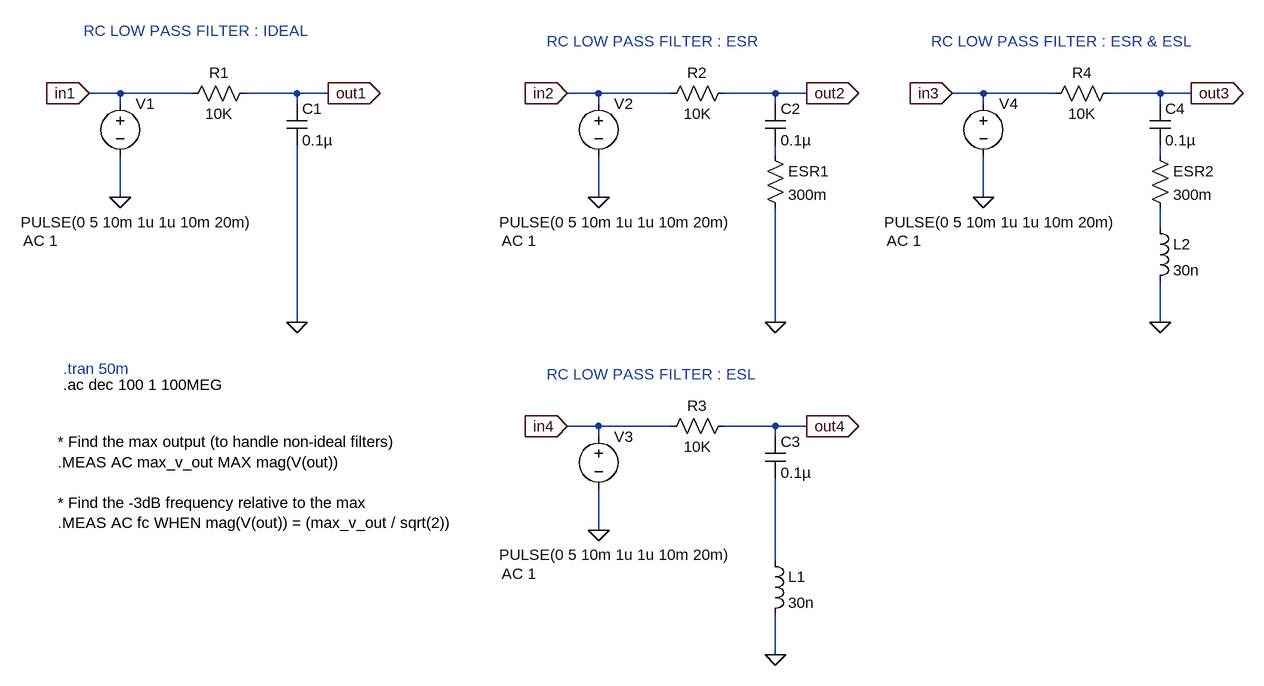
[diagram p0: schematic low_pass_filter_rc_ESR_ESL.asc]
low_pass_filter_rc_ESR_ESL.asc, the LTspice schematic file:
Version 4.1
SHEET 1 1392 980
WIRE -384 96 -432 96
WIRE -272 96 -384 96
WIRE -112 96 -192 96
WIRE -64 96 -112 96
WIRE 352 96 304 96
WIRE 464 96 352 96
WIRE 624 96 544 96
WIRE 672 96 624 96
WIRE 944 96 896 96
WIRE 1056 96 944 96
WIRE 1216 96 1136 96
WIRE 1264 96 1216 96
WIRE -384 112 -384 96
WIRE -112 112 -112 96
WIRE 352 112 352 96
WIRE 624 112 624 96
WIRE 944 112 944 96
WIRE 1216 112 1216 96
WIRE 624 192 624 176
WIRE 1216 192 1216 176
WIRE -384 256 -384 192
WIRE 352 256 352 192
WIRE 944 256 944 192
WIRE 1216 304 1216 272
WIRE -112 448 -112 176
WIRE 624 448 624 272
WIRE 1216 448 1216 384
WIRE 352 608 304 608
WIRE 464 608 352 608
WIRE 624 608 544 608
WIRE 672 608 624 608
WIRE 352 624 352 608
WIRE 624 624 624 608
WIRE 352 768 352 704
WIRE 624 816 624 688
WIRE 624 960 624 896
FLAG -384 256 0
FLAG -112 448 0
FLAG -432 96 in1
IOPIN -432 96 In
FLAG -64 96 out1
IOPIN -64 96 Out
FLAG 352 256 0
FLAG 624 448 0
FLAG 304 96 in2
IOPIN 304 96 In
FLAG 672 96 out2
IOPIN 672 96 Out
FLAG 352 768 0
FLAG 624 960 0
FLAG 304 608 in4
IOPIN 304 608 In
FLAG 672 608 out4
IOPIN 672 608 Out
FLAG 944 256 0
FLAG 1216 448 0
FLAG 896 96 in3
IOPIN 896 96 In
FLAG 1264 96 out3
IOPIN 1264 96 Out
SYMBOL res -176 80 R90
WINDOW 0 0 56 VBottom 2
WINDOW 3 32 56 VTop 2
SYMATTR InstName R1
SYMATTR Value 10K
SYMATTR SpiceLine tol=1 pwr=0.1
SYMBOL cap -128 112 R0
SYMATTR InstName C1
SYMATTR Value 0.1µ
SYMATTR SpiceLine V=4 Irms=0 Rser=0 Lser=0 mfg="Murata" pn="GRM022R60G153KE15" type="X5R"
SYMBOL voltage -384 96 R0
WINDOW 3 -153 198 Left 2
WINDOW 123 -149 227 Left 2
WINDOW 39 0 0 Left 0
SYMATTR Value PULSE(0 5 10m 1u 1u 10m 20m)
SYMATTR Value2 AC 1
SYMATTR InstName V1
SYMBOL res 560 80 R90
WINDOW 0 0 56 VBottom 2
WINDOW 3 32 56 VTop 2
SYMATTR InstName R2
SYMATTR Value 10K
SYMATTR SpiceLine tol=1 pwr=0.1
SYMBOL cap 608 112 R0
SYMATTR InstName C2
SYMATTR Value 0.1µ
SYMATTR SpiceLine V=4 Irms=0 Rser=0 Lser=0 mfg="Murata" pn="GRM022R60G153KE15" type="X5R"
SYMBOL voltage 352 96 R0
WINDOW 3 -153 198 Left 2
WINDOW 123 -149 227 Left 2
WINDOW 39 0 0 Left 0
SYMATTR Value PULSE(0 5 10m 1u 1u 10m 20m)
SYMATTR Value2 AC 1
SYMATTR InstName V2
SYMBOL res 608 176 R0
SYMATTR InstName ESR1
SYMATTR Value 300m
SYMBOL res 560 592 R90
WINDOW 0 0 56 VBottom 2
WINDOW 3 32 56 VTop 2
SYMATTR InstName R3
SYMATTR Value 10K
SYMATTR SpiceLine tol=1 pwr=0.1
SYMBOL cap 608 624 R0
SYMATTR InstName C3
SYMATTR Value 0.1µ
SYMATTR SpiceLine V=4 Irms=0 Rser=0 Lser=0 mfg="Murata" pn="GRM022R60G153KE15" type="X5R"
SYMBOL voltage 352 608 R0
WINDOW 3 -153 198 Left 2
WINDOW 123 -149 227 Left 2
WINDOW 39 0 0 Left 0
SYMATTR Value PULSE(0 5 10m 1u 1u 10m 20m)
SYMATTR Value2 AC 1
SYMATTR InstName V3
SYMBOL ind 608 800 R0
SYMATTR InstName L1
SYMATTR Value 30n
SYMATTR SpiceLine Rser=0
SYMBOL res 1152 80 R90
WINDOW 0 0 56 VBottom 2
WINDOW 3 32 56 VTop 2
SYMATTR InstName R4
SYMATTR Value 10K
SYMATTR SpiceLine tol=1 pwr=0.1
SYMBOL cap 1200 112 R0
SYMATTR InstName C4
SYMATTR Value 0.1µ
SYMATTR SpiceLine V=4 Irms=0 Rser=0 Lser=0 mfg="Murata" pn="GRM022R60G153KE15" type="X5R"
SYMBOL voltage 944 96 R0
WINDOW 3 -153 198 Left 2
WINDOW 123 -149 227 Left 2
WINDOW 39 0 0 Left 0
SYMATTR Value PULSE(0 5 10m 1u 1u 10m 20m)
SYMATTR Value2 AC 1
SYMATTR InstName V4
SYMBOL res 1200 176 R0
SYMATTR InstName ESR2
SYMATTR Value 300m
SYMBOL ind 1200 288 R0
SYMATTR InstName L2
SYMATTR Value 30n
SYMATTR SpiceLine Rser=0
TEXT -472 520 Left 2 ;.tran 50m
TEXT -472 544 Left 2 !.ac dec 100 1 100MEG
TEXT -480 632 Left 2 !* Find the max output (to handle non-ideal filters)\n.MEAS AC max_v_out MAX mag(V(out))\n \n* Find the -3dB frequency relative to the max\n.MEAS AC fc WHEN mag(V(out)) = (max_v_out / sqrt(2))
TEXT -440 0 Left 2 ;RC LOW PASS FILTER : IDEAL
TEXT 272 16 Left 2 ;RC LOW PASS FILTER : ESR
TEXT 272 528 Left 2 ;RC LOW PASS FILTER : ESL
TEXT 864 16 Left 2 ;RC LOW PASS FILTER : ESR & ESL

The netlist it stands for:
* low_pass_filter_rc_ESR_ESL.asc
R1 out1 in1 10K tol=1 pwr=0.1
C1 out1 0 0.1µ V=4 Irms=0 Rser=0 Lser=0 mfg="Murata" pn="GRM022R60G153KE15" type="X5R"
V1 in1 0 PULSE(0 5 10m 1u 1u 10m 20m) AC 1
R2 out2 in2 10K tol=1 pwr=0.1
C2 out2 N001 0.1µ V=4 Irms=0 Rser=0 Lser=0 mfg="Murata" pn="GRM022R60G153KE15" type="X5R"
V2 in2 0 PULSE(0 5 10m 1u 1u 10m 20m) AC 1
R§ESR1 N001 0 300m
R3 out4 in4 10K tol=1 pwr=0.1
C3 out4 N004 0.1µ V=4 Irms=0 Rser=0 Lser=0 mfg="Murata" pn="GRM022R60G153KE15" type="X5R"
V3 in4 0 PULSE(0 5 10m 1u 1u 10m 20m) AC 1
L1 N004 0 30n Rser=0
R4 out3 in3 10K tol=1 pwr=0.1
C4 out3 N002 0.1µ V=4 Irms=0 Rser=0 Lser=0 mfg="Murata" pn="GRM022R60G153KE15" type="X5R"
V4 in3 0 PULSE(0 5 10m 1u 1u 10m 20m) AC 1
R§ESR2 N002 N003 300m
L2 N003 0 30n Rser=0
* .tran 50m
.ac dec 100 1 100MEG
* Find the max output (to handle non-ideal filters)
.MEAS AC max_v_out MAX mag(V(out))
* Find the -3dB frequency relative to the max
.MEAS AC fc WHEN mag(V(out)) = (max_v_out / sqrt(2))
* RC LOW PASS FILTER : IDEAL
* RC LOW PASS FILTER : ESR
* RC LOW PASS FILTER : ESL
* RC LOW PASS FILTER : ESR & ESL
.backanno
.end

* Results of the author's LTspice run, read from the files saved beside the schematic
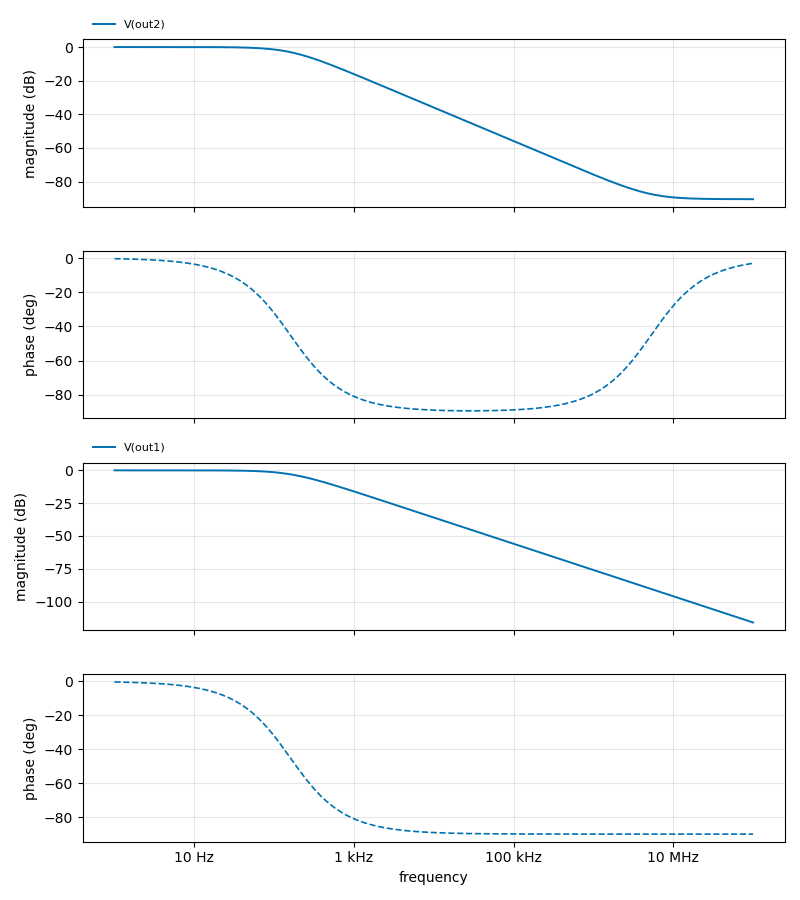
[diagram p1: AC Analysis of low_pass_filter_rc_ESR_ESL.asc, plotted from the saved traces]
* AC Analysis, 1 run:
*   V(out2): -0.00 dB at 1 Hz, -90.45 dB at 100 MHz, peak -0.00 dB at 1 Hz, 3 dB below the peak at 159.2 Hz
*   V(out1): -0.00 dB at 1 Hz, -115.96 dB at 100 MHz, peak -0.00 dB at 1 Hz, 3 dB below the peak at 159.2 Hz